# Altium project ROBOPCB3.PrjPcb
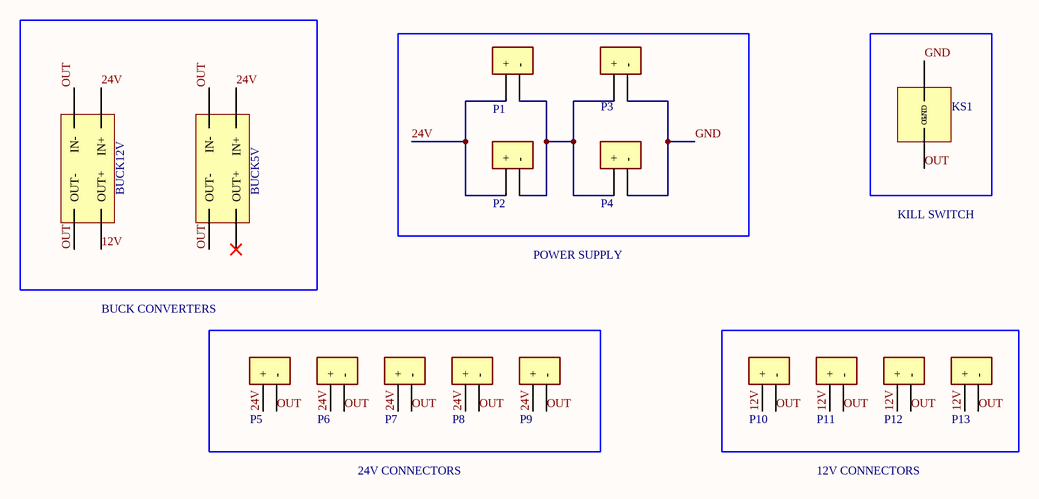
[diagram p0: Sheet1.SchDoc]
1 sheet, 16 parts. Net scope: global (net labels, ports and power ports of the same name join across sheets).
Board file: PCB1.PcbDoc

## Sheet Sheet1.SchDoc
size A4; SheetNumber: 1; SheetTotal: 1

### Parts
BUCK5V  BUCK  [BUCK]  (value not drawn)
BUCK12V  BUCK  [BUCK]  (value not drawn)
KS1  KS  [KS]  (value not drawn)
P1  282837-2  [TE_282837-2]  (value not drawn)
P2  282837-2  [TE_282837-2]  (value not drawn)
P3  282837-2  [TE_282837-2]  (value not drawn)
P4  282837-2  [TE_282837-2]  (value not drawn)
P5  282837-2  [TE_282837-2]  (value not drawn)
P6  282837-2  [TE_282837-2]  (value not drawn)
P7  282837-2  [TE_282837-2]  (value not drawn)
P8  282837-2  [TE_282837-2]  (value not drawn)
P9  282837-2  [TE_282837-2]  (value not drawn)
P10  282837-2  [TE_282837-2]  (value not drawn)
P11  282837-2  [TE_282837-2]  (value not drawn)
P12  282837-2  [TE_282837-2]  (value not drawn)
P13  282837-2  [TE_282837-2]  (value not drawn)

### Nets
12V: BUCK12V.3(OUT+) P10.1(+) P11.1(+) P12.1(+) P13.1(+)
24V: BUCK5V.1(IN+) BUCK12V.1(IN+) P1.1(+) P2.1(+) P5.1(+) P6.1(+) P7.1(+) P8.1(+) P9.1(+)
GND: KS1.2(GND) P3.2(-) P4.2(-)
OUT: BUCK5V.2(IN-) BUCK5V.4(OUT-) BUCK12V.2(IN-) BUCK12V.4(OUT-) KS1.1(OUT) P5.2(-) P6.2(-) P7.2(-) P8.2(-) P9.2(-) P10.2(-) P11.2(-) P12.2(-) P13.2(-)
NetP1_2: P1.2(-) P2.2(-) P3.1(+) P4.1(+)

Not connected (* = marked no-connect by the designer): BUCK5V 3(OUT+)*

### Notes on the sheet
- POWER SUPPLY
- KILL SWITCH
- BUCK CONVERTERS
- 24V CONNECTORS
- 12V CONNECTORS

### Library data of the parts
P1-P13 = 282837-2: Ð Ð°Ð·ÑŠÐµÐ¼Ð½Ñ‹Ðµ ÐºÐ»ÐµÐ¼Ð¼Ð½Ñ‹Ðµ ÐºÐ¾Ð»Ð¾Ð´ÐºÐ¸ Ð Ð¾Ð·ÐµÑ‚ÐºÐ° 2 Ð¿Ð¾Ð»Ð¾Ð¶ÐµÐ½Ð¸Ñ 5,08 Ð¼Ð¼ ÐŸÑ€Ð¸Ð¿Ð¾Ð¹ Ð¿Ñ€ÑÐ¼Ð¾Ð¹ Ñ‡ÐµÑ€ÐµÐ· Ð¾Ñ‚Ð²ÐµÑ€ÑÑ‚Ð¸Ðµ 13,5 Ð / ÐºÐ¾Ð½Ñ‚Ð°ÐºÑ‚; MF: TE Connectivity; SnapEDA_Link: https://www.snapeda.com/parts/282837-2/TE+Connectivity+AMP+Connectors/view-part/?ref=snap; Price: None; Check_prices: https://www.snapeda.com/parts/282837-2/TE+Connectivity+AMP+Connectors/view-part/?ref=eda; Purchase-URL: https://pricing.snapeda.com/search/part/282837-2/?ref=eda; MP: 282837-2; Value: *; Availability: In Stock; Package: None